# EasyEDA Pro project V2.0.1 KMX Switch.epro

# Schematic V2.0.1 Schematic
Board Name: V2.0.1 KMX Switch; Create Date: 2024-05-24; Page Name: Main Page; Project Name: Access Control KMX Switch; Schematic Name: V2.0.1 Schematic; Update Date: 2025-06-26
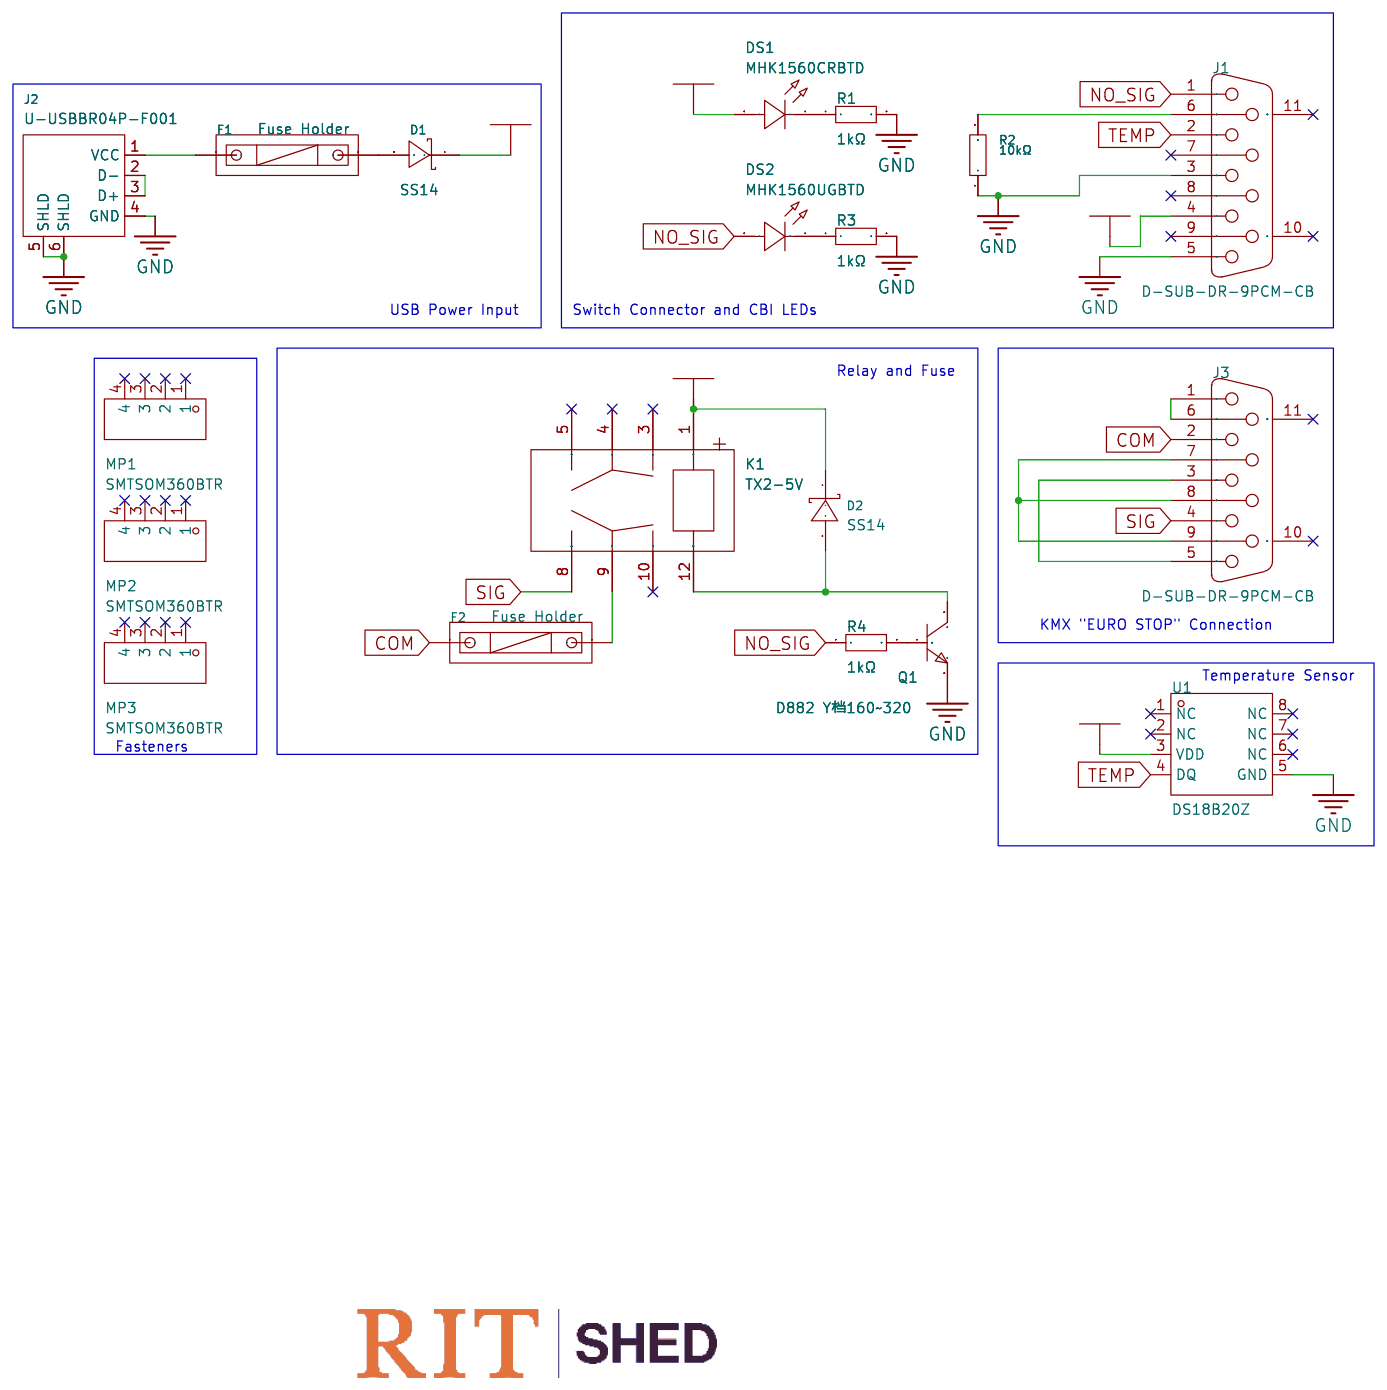
[diagram p0: schematic sheet]

## Parts
D1  SS14  [SMA_L4.2-W2.6-LS5.3-RD]
D2  SS14  [SMA_L4.2-W2.6-LS5.3-RD]
DS1  MHK1560CRBTD  [LED-TH_MHK1560UGBTD]
DS2  MHK1560UGBTD  [LED-TH_MHK1560UGBTD]
F1  Fuse Holder  [FUSE-TH_L24.5-W9.8-P22.5]
F2  Fuse Holder  [FUSE-TH_L24.5-W9.8-P22.5]
J1  D-SUB-DR-9PCM-CB  [DB9-TH_ID09S33E4GV00LF]
J2  U-USBBR04P-F001  [USB-B-TH_U241-041N-1BR85-1]
J3  D-SUB-DR-9PCM-CB  [DB9-TH_ID09S33E4GV00LF]
K1  TX2-5V  [RELAY-TH_TX2-3V]
MP1  SMTSOM360BTR  [SMD_BD5.6-D4.1]
MP2  SMTSOM360BTR  [SMD_BD5.6-D4.1]
MP3  SMTSOM360BTR  [SMD_BD5.6-D4.1]
Q1  D882 Y档160~320  [SOT-89-3_L4.5-W2.5-P1.50-LS4.2-BR]
R1  1kΩ  [R0805]
R2  10kΩ  [R0805]
R3  1kΩ  [R0805]
R4  1kΩ  [R0805]
U1  DS18B20Z  [SOP-8_L4.9-W3.9-P1.27-LS6.0-BL]

## Library data of the parts
D1 D2 = SS14_C2480: Diode Configuration:Single Forward Voltage (Vf@If):550mV@1A Reverse Voltage (Vr):40V Average Rectified Current (Io):1A Reverse Leakage Current (Ir):500uA@40V; LCSC Part Name: 电压:40V 电流:1A; Supplier Part: C2480; Manufacturer: MDD; Supplier Footprint: SMA(DO-214AC); JLCPCB Part Class: Basic Part; Datasheet: https://atta.szlcsc.com/upload/public/pdf/source/20230712/2DB6064CFBB99DE6DB116BEE8208BE66.pdf; Supplier: LCSC; Diode Configuration: Single; Forward Voltage (Vf@If): 550mV@1A; Reverse Voltage (Vr): 40V; Average Rectified Current (Io): 1A; Reverse Leakage Current (Ir): 500uA@40V
DS1 = MHK1560CGBTD: 20mA 雾状红透镜 50mcd -40℃~+85℃ 632nm Red 85° 1.75V~2.2V Plugin,P=2.54mm Light Emitting Diodes (LED) ROHS; LCSC Part Name: 1560直插单灯翠绿色光; Supplier Part: C7470835; Manufacturer: MEIHUA(美华); Supplier Footprint: 插件,P=2.54mm; JLCPCB Part Class: Extended Part; Datasheet: https://atta.szlcsc.com/upload/public/pdf/source/20231114/0151DB1F997DCF286213A722D08B4BAA.pdf; Supplier: LCSC; Emitted Color: Emerald; Forward Voltage (VF): 1.75V~2.2V; Forward Current: 20mA; Dominant Wavelength: 520nm; Lens Color: 雾状绿透镜; Luminous Intensity: 1000mcd; Viewing Angle: 85°; Operating Temperature: -40℃~+85℃
DS2 = MHK1560UGBTD: Emitted Color:Emerald Forward Voltage (VF):1.75V~2.2V Forward Voltage (VF):1.75V~2.2V Forward Current:20mA Dominant Wavelength:520nm Dominant Wavelength:520nm Lens Color:雾状绿透镜 Luminous Intensity:1000mcd Luminous Intensity:1000mcd Viewing Angle:85° Operati; LCSC Part Name: 1560直插单灯翠绿色光; Supplier Part: C7470833; Manufacturer: MEIHUA(美华); Supplier Footprint: 插件,P=2.54mm; JLCPCB Part Class: Extended Part; Datasheet: https://atta.szlcsc.com/upload/public/pdf/source/20231114/0151DB1F997DCF286213A722D08B4BAA.pdf; Supplier: LCSC; Emitted Color: Emerald; Forward Voltage (VF): 1.75V~2.2V; Forward Current: 20mA; Dominant Wavelength: 520nm; Lens Color: 雾状绿透镜; Luminous Intensity: 1000mcd; Viewing Angle: 85°; Operating Temperature: -40℃~+85℃
F1 F2 = 保险丝透明座: Fuseholder Type:- Fuse Type:- Fuse Size:-; LCSC Part Name: 保险丝座 5*20 透明座(两件套); Supplier Part: C58066; Manufacturer: xcfuse(旭程); JLCPCB Part Class: Extended Part; Datasheet: https://atta.szlcsc.com/upload/public/pdf/source/20201109/C58066_EF84FEEE40948BE1BD26BCA72E4FE443.pdf; Supplier: LCSC
J1 J3 = D-SUB-DR-9PCM-CB: Connector Type:D-Sub Gender:Female Number of Pins:9P Mounting Style:Right-Angle Number of Rows:2 Current Rating (Max):3A Contact Plating:Tin Operating Temperature Range:-50℃~+105℃ Operating Temperature Range:-50℃~+105℃; LCSC Part Name: D-Sub 母 P数:9P; Supplier Part: C19077337; Manufacturer: XUNPU(讯普); Supplier Footprint: 弯插; JLCPCB Part Class: Extended Part; Datasheet: https://atta.szlcsc.com/upload/public/pdf/source/20231108/FB2E8AB0BE4F620DDF3F7F4D0B9AFB97.pdf; Supplier: LCSC; Connector Type: D-Sub; Gender: Female; Number of Pins: 9P; Mounting Style: Right-Angle; Number of Rows: 2; Current Rating (Max): 3A; Contact Plating: Tin; Operating Temperature Range: -50℃~+105℃
J2 = U-USBBR04P-F001: Connector Type:Type-B Standard:USB 2.0 Gender:Female Number of Ports:1 Number of Contacts:4P Mounting Style:Right-Angle Current Rating - Power (Max):1.5A Operating Temperature Range:- Operating Temperature Range:-; LCSC Part Name: Type-B 母 弯插; Supplier Part: C386743; Manufacturer: Ckmtw(灿科盟); Supplier Footprint: 插件; JLCPCB Part Class: Extended Part; Datasheet: https://atta.szlcsc.com/upload/public/pdf/source/20190509/C386743_2E7BDE199FB40B6F97679D15D491C286.pdf; Supplier: LCSC; Connector Type: Type-B; Standard: USB 2.0; Gender: Female; Number of Ports: 1; Number of Contacts: 4P; Mounting Style: Right-Angle; Current Rating - Power (Max): 1.5A
K1 = TX2-5V: Coil Voltage:5V Contact Form:两组转换:2C(DPDT-转换) Pin Number:- Contact Rating:- Maximum Switching Voltage:220V@DC Contact Material:silver+Gold plating Coil Resistance:- Maximum Switching Current:2A Operate Time:4ms Release Time:4ms Coil Type:- Contact Resista; Supplier Part: C192257; Manufacturer: PANASONIC(松下); Supplier Footprint: DIP,7.4x15mm; JLCPCB Part Class: Extended Part; Datasheet: https://atta.szlcsc.com/upload/public/pdf/source/20180524/C192257_90ABE86BE073F309F1A3B364AFE43747.pdf; Supplier: LCSC; Coil Voltage: 5V; Contact Form: 两组转换:2C(DPDT-转换); Maximum Switching Voltage: 220V@DC; Contact Material: silver+Gold plating; Maximum Switching Current: 2A; Operate Time: 4ms; Release Time: 4ms; Operating Temperature: -40℃~+85℃
MP1-MP3 = SMTSOM360BTR: LCSC Part Name: YIYUAN(怡远)M3贴片螺母 铜镀锡 PCB贴片连接器SMTSOM360BTR; Supplier Part: C5221846; Manufacturer: YIYUAN(怡远); JLCPCB Part Class: Extended Part; Datasheet: https://atta.szlcsc.com/upload/public/pdf/source/20230202/A42D22DA7D93D728E13784C4003E4077.pdf; Supplier: LCSC
Q1 = D882 Y档160~320: Transistor Type: Collector Current (Ic): Collector-Emitter Breakdown Voltage (Vceo): Power Dissipation (Pd):; LCSC Part Name: D882 Y档160~320(RANGE:160-320) Y档 160~320; Supplier Part: C9634; Manufacturer: CJ(江苏长电/长晶); Supplier Footprint: SOT-89-3; JLCPCB Part Class: Basic Part; Datasheet: https://atta.szlcsc.com/upload/public/pdf/source/20121027/1457706543612.pdf; Supplier: LCSC
R1 R3 R4 = 0805W8F1001T5E: Type:Thick Film Resistors Resistance:1kΩ Tolerance:±1% Tolerance:±1% Power(Watts): Overload Voltage (Max): Temperature Coefficient:±100ppm/℃ Temperature Coefficient:±100ppm/℃ Operating Temperature Range:-55℃~+155℃ Operating Temperature Range:-55℃~+155℃; LCSC Part Name: 1kΩ ±1% 125mW 厚膜电阻; Supplier Part: C17513; Manufacturer: UNI-ROYAL(厚声); Supplier Footprint: 0805; JLCPCB Part Class: Basic Part; Datasheet: https://atta.szlcsc.com/upload/public/pdf/source/20200306/C422600_1E6D84923E4A46A82E41ADD87F860B5C.pdf; Supplier: LCSC; Type: Thick Film Resistors; Tolerance: ±1%; Temperature Coefficient: ±100ppm/℃; Operating Temperature Range: -55℃~+155℃
R2 = 0805W8F1002T5E: Type:Thick Film Resistors Resistance:10kΩ Tolerance:±1% Tolerance:±1% Power(Watts): Overload Voltage (Max): Temperature Coefficient:±100ppm/℃ Temperature Coefficient:±100ppm/℃ Operating Temperature Range:-55℃~+155℃ Operating Temperature Range:-55℃~+155℃; LCSC Part Name: 10kΩ ±1% 125mW 厚膜电阻; Supplier Part: C17414; Manufacturer: UNI-ROYAL(厚声); Supplier Footprint: 0805; JLCPCB Part Class: Basic Part; Datasheet: https://atta.szlcsc.com/upload/public/pdf/source/20200306/C422600_1E6D84923E4A46A82E41ADD87F860B5C.pdf; Supplier: LCSC; Type: Thick Film Resistors; Tolerance: ±1%; Temperature Coefficient: ±100ppm/℃; Operating Temperature Range: -55℃~+155℃
U1 = DS18B20Z: Resolution:±0.4℃ Resolution:±0.4℃ Supply Voltage:2.5V~5.5V Supply Voltage:2.5V~5.5V; LCSC Part Name: 温度传感器; Supplier Part: C695837; Manufacturer: UMW(友台半导体); Supplier Footprint: SOIC-8; JLCPCB Part Class: Extended Part; Datasheet: https://atta.szlcsc.com/upload/public/pdf/source/20231109/DC3DA9D47D486EF40A6E0F08B9A498E3.pdf; Supplier: LCSC; Resolution: ±0.4℃; Supply Voltage: 2.5V~5.5V

## Nets
GND: J1.3 J1.5 J2.4(GND) J2.5(SHLD) J2.6(SHLD) Q1.3(E) R1.2 R2.1 R3.2 U1.5(GND)
COM: F2.1 J3.2
NO_SIG: DS2.2(A) J1.1 R4.1
SIG: J3.4 K1.8
TEMP: J1.2 U1.4(DQ)
VSW: D1.1(K) D2.1(K) DS1.2(A) J1.4 K1.1 U1.3(VDD)
$1N839: D2.2(A) K1.12 Q1.2(C)
$1N4107: J1.6 R2.2
$1N5830: F1.1 J2.1(VCC)
$1N5854: J2.2(D-) J2.3(D+)
$1N5904: J3.1 J3.6
$1N5916: J3.3 J3.5
$1N5926: J3.7 J3.8 J3.9
$1N6140: F2.2 K1.9
$1N7369: D1.2(A) F1.2
$1N7449: DS2.1(K) R3.1
$1N7489: DS1.1(K) R1.1
$1N7723: Q1.1(B) R4.2

Not connected (* = marked no-connect by the designer): J1 7* 8* 9* 10(MH1)* 11(MH2)*; J3 10(MH1)* 11(MH2)*; K1 3* 4* 5* 10*; MP1 1* 2* 3* 4*; MP2 1* 2* 3* 4*; MP3 1* 2* 3* 4*; U1 1(NC)* 2(NC)* 6(NC)* 7(NC)* 8(NC)*

## Notes on the sheet
- USB Power Input
- Switch Connector and CBI LEDs
- Relay and Fuse
- KMX "EURO STOP" Connection
- Temperature Sensor
- Fasteners

# Board V2.0.1 PCB
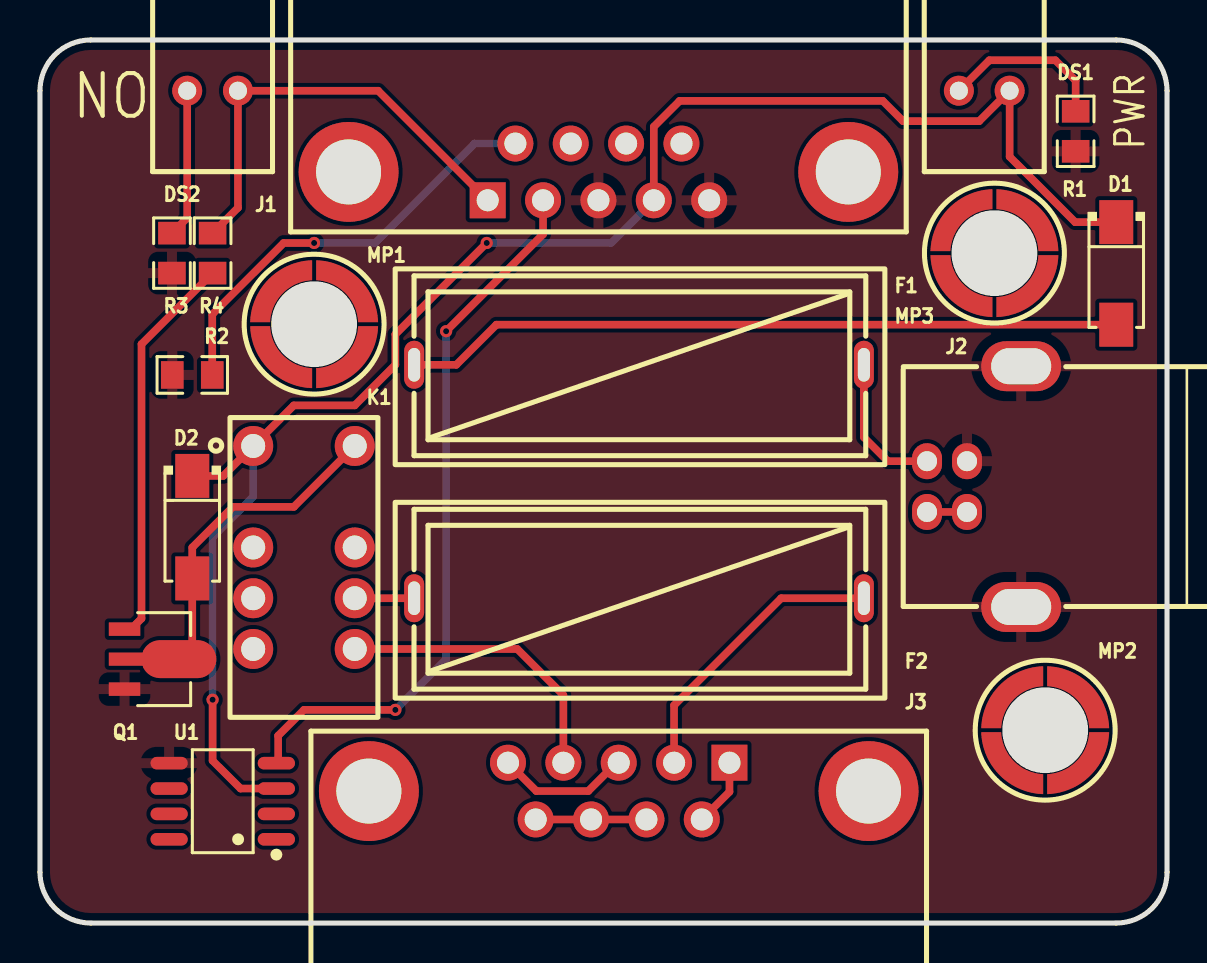
[diagram p1: board, top side]
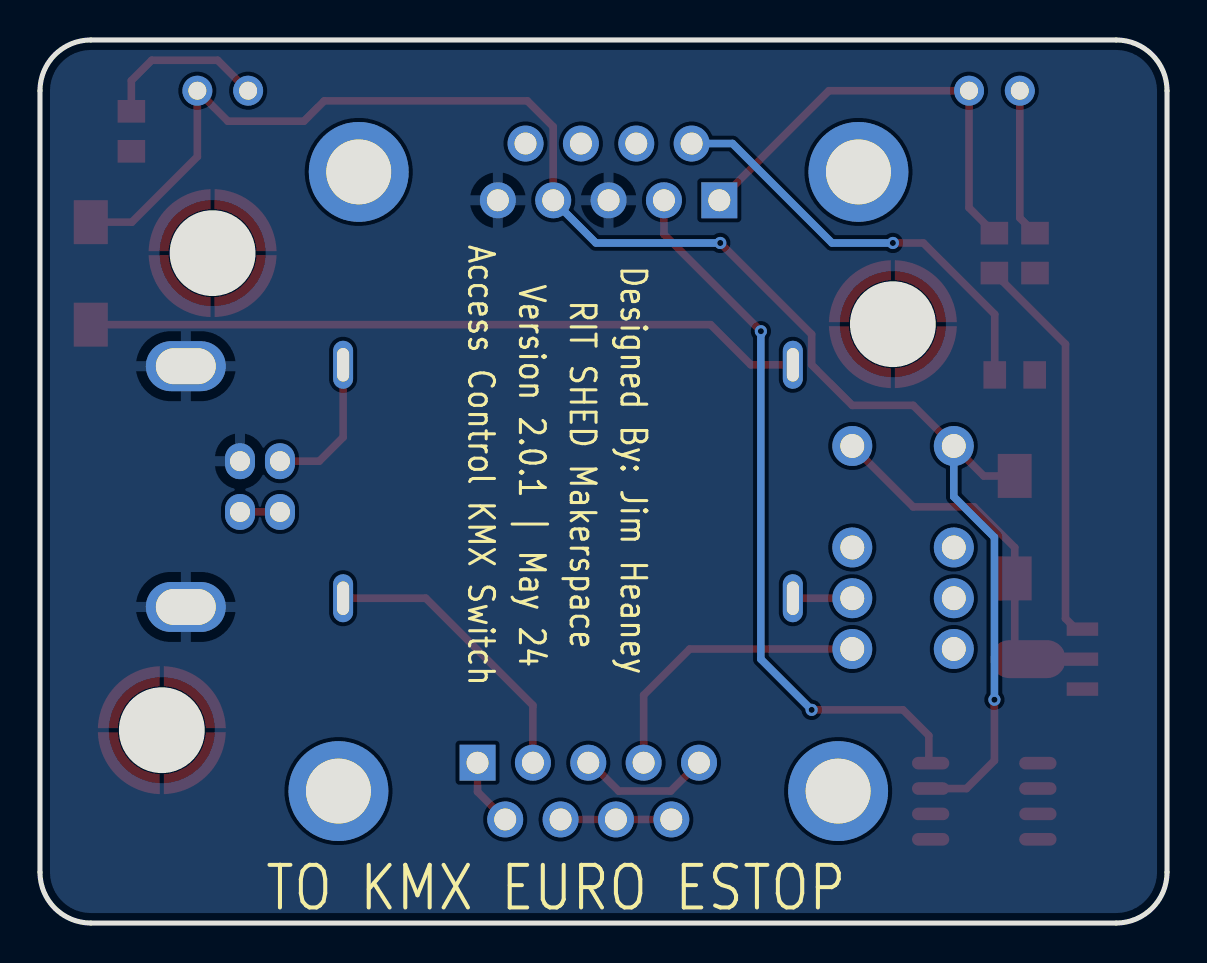
[diagram p2: board, bottom side, seen from below]

Outline 56.39 x 44.2 mm; copper layers: Top Layer, Bottom Layer. Coordinates in mm from the lower left corner of the outline.
Outline path: 0,41.66 0,2.54 arc(0.74,0.74) 2.54,0 53.85,0 arc(55.64,0.74) 56.39,2.54 56.39,41.66 arc(55.64,43.45) 53.85,44.2 2.54,44.2 arc(0.74,43.45) 0,41.66
Stack: Top Layer 0.035mm / Dielectric1 1.51mm FR4 er 4.5 / Bottom Layer 0.035mm

## Design rules (mm)
template: JLCPCB Capability(Two Layers Board)
spacing copperThickness1oz (default): track to track 0.102, other pairs 0.152 to 0.3
spacing copperThickness2oz: track to track 0.203, other pairs 0.152 to 0.3
track width copperThickness1oz (default): min 0.127, default 0.254, max 2.54
track width copperThickness2oz: min 0.203, default 0.254, max 2.54
differential pair differentialPair (default): width min 0.127, default 0.254, max 2.54; gap min 0.152, default 0.152
via viaSize (default): diameter min 0.5, default 0.61, max 10; hole min 0.3, default 0.305, max 6.3

## Placement (name value [footprint] x y rotation side)
D1  SS14  [SMA_L4.2-W2.6-LS5.3-RD]  53.85 32.51 270 top
D2  SS14  [SMA_L4.2-W2.6-LS5.3-RD]  7.62 19.81 270 top
DS1  MHK1560CRBTD  [LED-TH_MHK1560UGBTD]  47.24 41.66 180 top
DS2  MHK1560UGBTD  [LED-TH_MHK1560UGBTD]  8.64 41.66 180 top
F1  Fuse Holder  [FUSE-TH_L24.5-W9.8-P22.5]  29.97 27.94 180 top
F2  Fuse Holder  [FUSE-TH_L24.5-W9.8-P22.5]  29.97 16.26 180 top
J1  D-SUB-DR-9PCM-CB  [DB9-TH_ID09S33E4GV00LF]  27.94 37.59 180 top
J2  U-USBBR04P-F001  [USB-B-TH_U241-041N-1BR85-1]  46.74 21.84 90 top
J3  D-SUB-DR-9PCM-CB  [DB9-TH_ID09S33E4GV00LF]  28.96 6.6 0 top
K1  TX2-5V  [RELAY-TH_TX2-3V]  13.21 18.8 270 top
MP1  SMTSOM360BTR  [SMD_BD5.6-D4.1]  13.72 29.97 0 top
MP2  SMTSOM360BTR  [SMD_BD5.6-D4.1]  50.29 9.65 0 top
MP3  SMTSOM360BTR  [SMD_BD5.6-D4.1]  47.75 33.53 0 top
Q1  D882 Y档160~320  [SOT-89-3_L4.5-W2.5-P1.50-LS4.2-BR]  5.59 13.21 180 top
R1  1kΩ  [R0805]  51.82 39.62 270 top
R2  10kΩ  [R0805]  7.62 27.43 0 top
R3  1kΩ  [R0805]  6.6 33.53 270 top
R4  1kΩ  [R0805]  8.64 33.53 270 top
U1  DS18B20Z  [SOP-8_L4.9-W3.9-P1.27-LS6.0-BL]  9.14 6.1 90 top

## Footprints (pads in the part's own frame, mm; a bottom-side part is the same pattern mirrored in y, then rotated)
DB9-TH_ID09S33E4GV00LF
  rect 1.8x1.8 hole 1.1: 1(5.54,1.42)
  round 1.8 hole 1.1: 2(2.77,1.42) 3(0,1.42) 4(-2.77,1.42) 5(-5.54,1.42) 6(4.155,-1.42) 7(1.385,-1.42) 8(-1.385,-1.42) 9(-4.155,-1.42)
  round 5 hole 3.25: 10(-12.5,0) 11(12.5,0)
FUSE-TH_L24.5-W9.8-P22.5
  oval 1x2.4 hole 0.6x1.68: 1(-11.25,0) 2(11.25,0)
LED-TH_MHK1560UGBTD
  round 1.5 hole 0.9: 1(1.27,0) 2(-1.27,0)
R0805
  rect 1.133x1.377 smd: 1(-1,0) 2(1,0)
RELAY-TH_TX2-3V
  round 2 hole 1.2: 1(-5.08,-2.54) 3(0,-2.54) 4(2.54,-2.54) 5(5.08,-2.54) 8(5.08,2.54) 9(2.54,2.54) 10(0,2.54) 12(-5.08,2.54)
SMA_L4.2-W2.6-LS5.3-RD
  rect 2.2x1.7 smd: 1(-2.566,0) 2(2.566,0)
SMD_BD5.6-D4.1
  custom 3.1x3.1 smd: 1(-2.102,1.65) 2(1.65,2.102) 3(2.102,-1.65) 4(-1.65,-2.102)
SOP-8_L4.9-W3.9-P1.27-LS6.0-BL
  oval 0.63x1.865 smd: 1(-1.905,-2.683) 2(-0.635,-2.683) 3(0.635,-2.683) 4(1.905,-2.683) 5(1.905,2.683) 6(0.635,2.683) 7(-0.635,2.683) 8(-1.905,2.683)
SOT-89-3_L4.5-W2.5-P1.50-LS4.2-BR
  rect 1.575x0.672 smd: 1(1.356,-1.5) 3(1.356,1.5)
  custom 5.377x1.9 smd: 2(-1.356,0)
USB-B-TH_U241-041N-1BR85-1
  oval 1.8x1.5 hole 1: 1(1.27,2.355) 2(-1.27,2.355) 3(-1.27,0.355) 4(1.27,0.355)
  oval 2.5x4 hole 1.8x3: 5(6.025,-2.355) 6(-6.025,-2.355)

## Nets
As in the schematic.

Pads without a net: J1 7 8 9 10 11; J3 10 11; K1 3 4 5 10; MP1 1 2 3 4; MP2 1 2 3 4; MP3 1 2 3 4; U1 1 2 6 7 8

## Via types
v1: diameter 0.61, hole 0.305, Top Layer to Bottom Layer, 5 vias

## Routing (per net, layer and track width the routed paths; a pad name or vN(x,y) marks a point on that pad's centre or on a via; arc(x,y) is an arc through that point)
COM: length 14.6
  Top Layer w0.381: F2.1 37.08,16.26 31.73,10.9 J3.2
NO_SIG: length 22.4
  Top Layer w0.381: R4.1 9.91,35.8 DS2.2 16.92,41.66 J1.1
SIG: length 14.8
  Top Layer w0.381: J3.4 26.19,11.41 23.88,13.72 K1.8
TEMP: length 36.3
  Top Layer w0.381: 11.92,8 11.92,9.38 13.21,10.67 v1(17.78,10.67) ; v1(20.32,29.62) 25.17,34.47 J1.2
  Bottom Layer w0.381: v1(20.32,29.62) 20.32,13.21 v1(17.78,10.67)
VSW: length 83.2
  Top Layer w0.381: J1.4 30.71,39.85 32,41.15 42.16,41.15 43.18,40.13 46.99,40.13 DS1.2 48.51,38.35 51.79,35.08 D1.1 ; v1(8.64,11.18) 8.64,8.13 10.03,6.73 11.92,6.73 ; D2.1 9.17,22.38 K1.1 12.7,25.91 15.75,25.91 17.78,27.94 17.78,29.46 v1(22.35,34.04)
  Bottom Layer w0.381: K1.1 10.67,21.34 8.64,19.3 v1(8.64,11.18) ; v1(22.35,34.04) 28.57,34.04 J1.4
$1N839: length 16.1
  Top Layer w0.381: K1.12 12.7,20.83 9.65,20.83 7.62,18.8 D2.2 7.62,13.88 Q1.2
$1N4107: length 21.7
  Top Layer w0.381: R2.2 8.62,30.46 12.19,34.04 v1(13.72,34.04)
  Bottom Layer w0.381: J1.6 21.74,39.01 16.76,34.04 v1(13.72,34.04)
$1N5830: length 7.3
  Top Layer w0.381: 44.38,23.11 42.42,23.11 41.22,24.31 F1.1
$1N5854: length 2
  Top Layer w0.381: 44.38,20.57 46.38,20.57
$1N5904: length 3.4
  Top Layer w0.381: J3.6 34.5,6.57 J3.1
$1N5916: length 6.7
  Top Layer w0.381: J3.5 24.84,6.6 27.43,6.6 28.85,8.02 J3.3
$1N5926: length 5.5
  Top Layer w0.381: J3.9 J3.8 J3.7
$1N6140: length 3
  Top Layer w0.381: K1.9 F2.2
$1N7369: length 36
  Top Layer w0.381: D1.2 22.83,29.95 20.83,27.94 F1.2
$1N7449: length 7.4
  Top Layer w0.381: R3.1 7.37,35.29 DS2.1
$1N7489: length 8.4
  Top Layer w0.381: DS1.1 47.5,43.18 50.8,43.18 51.82,42.16 R1.1
$1N7723: length 19.8
  Top Layer w0.381: R4.2 5.08,28.97 5.08,15.24 4.55,14.71 Q1.1

## Copper pours and planes (outline as drawn; the poured copper is in the pictures)
GND on Top Layer: -1.02,57.4 56.9,57.4 56.9,-11.18 -1.02,-11.18
GND on Bottom Layer: -11.68,44.7 66.55,44.7 66.55,-1.02 -11.68,-1.02

## Text on the board
Bottom Silkscreen Layer: Designed By: Jim Heaney | RIT SHED Makerspace | Version 2.0.1 | May 24 | Access Control KMX Switch | TO KMX EURO ESTOP
Top Silkscreen Layer: PWR | NO
